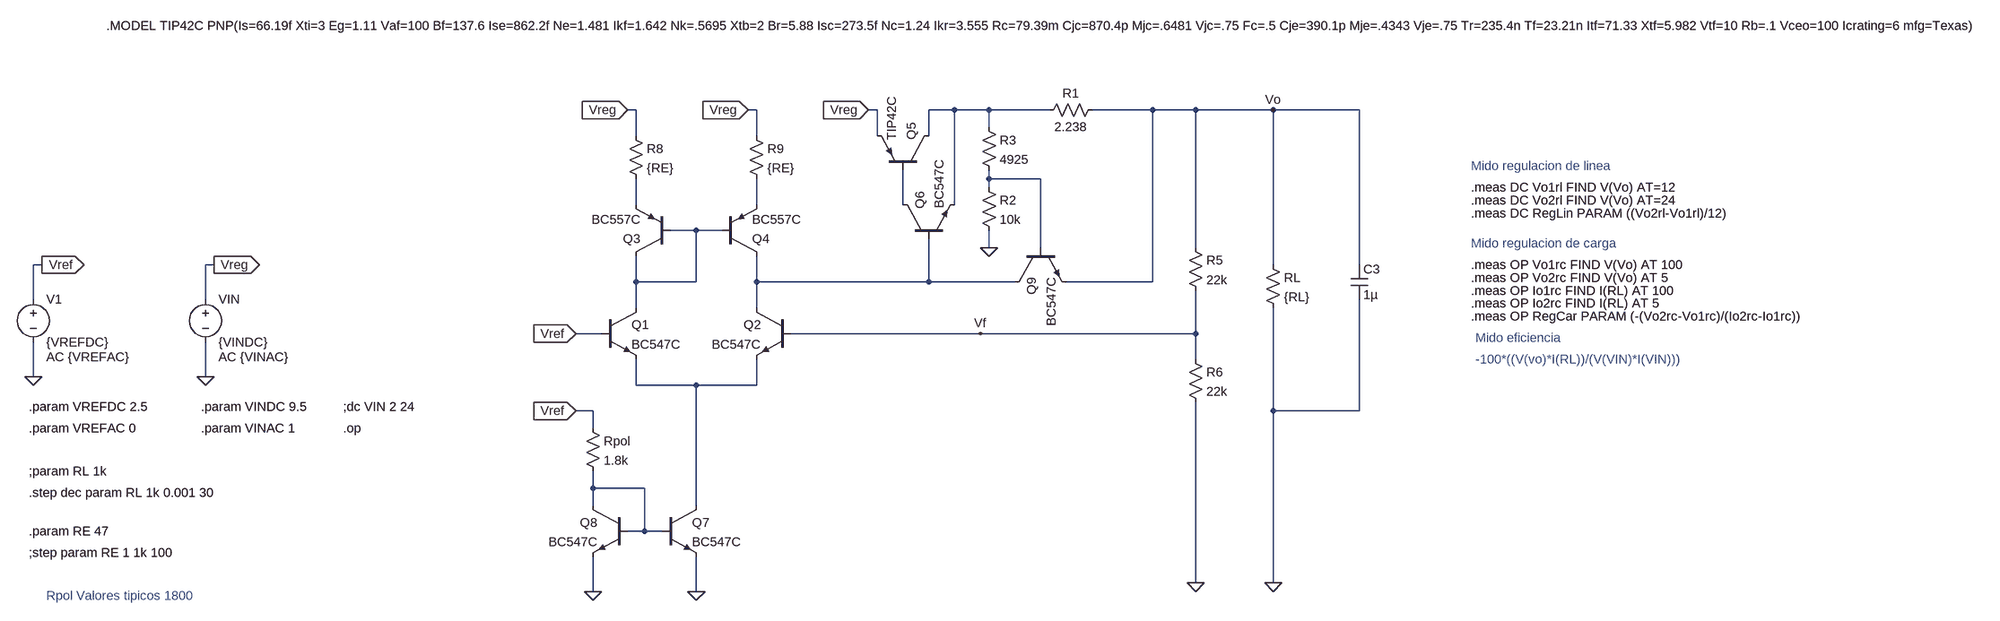
[diagram p0: schematic Version 2.asc]
Version 2.asc, the LTspice schematic file:
Version 4.1
SHEET 1 3148 1188
WIRE 96 -128 80 -128
WIRE 320 -128 304 -128
WIRE 544 -128 528 -128
WIRE 688 -128 640 -128
WIRE 752 -128 688 -128
WIRE 864 -128 752 -128
WIRE 1056 -128 944 -128
WIRE 1136 -128 1056 -128
WIRE 1280 -128 1136 -128
WIRE 1440 -128 1280 -128
WIRE 752 -96 752 -128
WIRE 96 -80 96 -128
WIRE 320 -80 320 -128
WIRE 544 -80 544 -128
WIRE 640 -80 640 -128
WIRE 752 0 752 -16
WIRE 848 0 752 0
WIRE 752 16 752 0
WIRE 96 48 96 0
WIRE 320 48 320 0
WIRE 592 48 592 -16
WIRE 688 48 688 -128
WIRE 208 96 160 96
WIRE 256 96 208 96
WIRE 752 128 752 96
WIRE 848 128 848 0
WIRE 1136 128 1136 -128
WIRE -1008 160 -1024 160
WIRE -688 160 -704 160
WIRE 1280 160 1280 -128
WIRE 1440 160 1440 -128
WIRE 96 192 96 144
WIRE 208 192 208 96
WIRE 208 192 96 192
WIRE 320 192 320 144
WIRE 640 192 640 112
WIRE 640 192 320 192
WIRE 800 192 640 192
WIRE 1056 192 1056 -128
WIRE 1056 192 896 192
WIRE -1024 224 -1024 160
WIRE -704 224 -704 160
WIRE 96 240 96 192
WIRE 320 240 320 192
WIRE 32 288 -16 288
WIRE 736 288 384 288
WIRE 1136 288 1136 208
WIRE 1136 288 736 288
WIRE 1136 336 1136 288
WIRE -1024 368 -1024 304
WIRE -704 368 -704 304
WIRE 96 384 96 336
WIRE 208 384 96 384
WIRE 320 384 320 336
WIRE 320 384 208 384
WIRE 16 432 -16 432
WIRE 1280 432 1280 240
WIRE 1440 432 1440 224
WIRE 1440 432 1280 432
WIRE 16 464 16 432
WIRE 16 576 16 544
WIRE 112 576 16 576
WIRE 16 608 16 576
WIRE 208 608 208 384
WIRE 112 656 112 576
WIRE 112 656 80 656
WIRE 144 656 112 656
WIRE 1136 752 1136 416
WIRE 1280 752 1280 432
WIRE 16 768 16 704
WIRE 208 768 208 704
FLAG 1280 -128 Vo
FLAG -1008 160 Vref
IOPIN -1008 160 Out
FLAG 736 288 Vf
FLAG -1024 368 0
FLAG -688 160 Vreg
IOPIN -688 160 Out
FLAG 1280 752 0
FLAG 1136 752 0
FLAG -16 288 Vref
IOPIN -16 288 In
FLAG -16 432 Vref
IOPIN -16 432 In
FLAG -704 368 0
FLAG 16 768 0
FLAG 208 768 0
FLAG 80 -128 Vreg
IOPIN 80 -128 In
FLAG 304 -128 Vreg
IOPIN 304 -128 In
FLAG 528 -128 Vreg
IOPIN 528 -128 In
FLAG 752 128 0
DATAFLAG 1440 -112 ""
DATAFLAG 512 288 ""
DATAFLAG 16 288 ""
DATAFLAG 368 192 ""
DATAFLAG 112 192 ""
DATAFLAG 224 96 ""
DATAFLAG 320 32 ""
SYMBOL pnp 160 144 R180
SYMATTR InstName Q3
SYMATTR Value BC557C
SYMBOL pnp 256 144 M180
SYMATTR InstName Q4
SYMATTR Value BC557C
SYMBOL npn 32 240 R0
SYMATTR InstName Q1
SYMATTR Value BC547C
SYMBOL npn 384 240 M0
SYMATTR InstName Q2
SYMATTR Value BC547C
SYMBOL pnp 640 -16 M270
SYMATTR InstName Q5
SYMATTR Value TIP42C
SYMBOL npn 592 112 R270
SYMATTR InstName Q6
SYMATTR Value BC547C
SYMBOL res 1120 112 R0
SYMATTR InstName R5
SYMATTR Value 22k
SYMBOL res 1120 320 R0
SYMATTR InstName R6
SYMATTR Value 22k
SYMBOL res 1264 144 R0
SYMATTR InstName RL
SYMATTR Value {RL}
SYMBOL voltage -1024 208 R0
WINDOW 123 24 124 Left 2
WINDOW 39 0 0 Left 0
SYMATTR Value2 AC {VREFAC}
SYMATTR InstName V1
SYMATTR Value {VREFDC}
SYMBOL res 80 -96 R0
SYMATTR InstName R8
SYMATTR Value {RE}
SYMBOL res 304 -96 R0
SYMATTR InstName R9
SYMATTR Value {RE}
SYMBOL cap 1424 160 R0
SYMATTR InstName C3
SYMATTR Value 1µ
SYMBOL voltage -704 208 R0
WINDOW 123 24 124 Left 2
WINDOW 39 0 0 Left 0
SYMATTR Value2 AC {VINAC}
SYMATTR InstName VIN
SYMATTR Value {VINDC}
SYMBOL npn 144 608 R0
SYMATTR InstName Q7
SYMATTR Value BC547C
SYMBOL npn 80 608 M0
SYMATTR InstName Q8
SYMATTR Value BC547C
SYMBOL res 0 448 R0
SYMATTR InstName Rpol
SYMATTR Value 1.8k
SYMBOL npn 800 128 M90
SYMATTR InstName Q9
SYMATTR Value BC547C
SYMBOL res 960 -144 R90
WINDOW 0 0 56 VBottom 2
WINDOW 3 32 56 VTop 2
SYMATTR InstName R1
SYMATTR Value 2.238
SYMBOL res 736 0 R0
SYMATTR InstName R2
SYMATTR Value 10k
SYMBOL res 736 -112 R0
SYMATTR InstName R3
SYMATTR Value 4925
TEXT -448 464 Left 2 !.op
TEXT -712 424 Left 2 !.param VINDC 9.5
TEXT -712 464 Left 2 !.param VINAC 1
TEXT -1032 424 Left 2 !.param VREFDC 2.5
TEXT -1032 464 Left 2 !.param VREFAC 0
TEXT -1032 544 Left 2 !;param RL 1k
TEXT -448 424 Left 2 !;dc VIN 2 24
TEXT -1032 696 Left 2 !;step param RE 1 1k 100
TEXT -1032 656 Left 2 !.param RE 47
TEXT -1032 584 Left 2 !.step dec param RL 1k 0.001 30
TEXT 1648 -24 Left 2 ;Mido regulacion de linea
TEXT 1648 16 Left 2 !.meas DC Vo1rl FIND V(Vo) AT=12
TEXT 1648 40 Left 2 !.meas DC Vo2rl FIND V(Vo) AT=24
TEXT 1648 64 Left 2 !.meas DC RegLin PARAM ((Vo2rl-Vo1rl)/12)
TEXT 1648 120 Left 2 ;Mido regulacion de carga
TEXT 1648 160 Left 2 !.meas OP Vo1rc FIND V(Vo) AT 100
TEXT 1648 184 Left 2 !.meas OP Vo2rc FIND V(Vo) AT 5
TEXT 1648 208 Left 2 !.meas OP Io1rc FIND I(RL) AT 100
TEXT 1648 232 Left 2 !.meas OP Io2rc FIND I(RL) AT 5
TEXT 1656 296 Left 2 ;Mido eficiencia
TEXT 1656 336 Left 2 ;-100*((V(vo)*I(RL))/(V(VIN)*I(VIN)))
TEXT 1648 256 Left 2 !.meas OP RegCar PARAM (-(Vo2rc-Vo1rc)/(Io2rc-Io1rc))
TEXT -1000 776 Left 2 ;Rpol Valores tipicos 1800
TEXT -888 -312 Left 2 !.MODEL TIP42C PNP(Is=66.19f Xti=3 Eg=1.11 Vaf=100 Bf=137.6 Ise=862.2f Ne=1.481 Ikf=1.642 Nk=.5695 Xtb=2 Br=5.88 Isc=273.5f Nc=1.24 Ikr=3.555 Rc=79.39m Cjc=870.4p Mjc=.6481 Vjc=.75 Fc=.5 Cje=390.1p Mje=.4343 Vje=.75 Tr=235.4n Tf=23.21n Itf=71.33 Xtf=5.982 Vtf=10 Rb=.1 Vceo=100 Icrating=6 mfg=Texas)

The netlist it stands for:
* Version 2.asc
Q3 N006 N006 N003 0 BC557C
Q4 N007 N006 N004 0 BC557C
Q1 N006 Vref N008 0 BC547C
Q2 N007 Vf N008 0 BC547C
Q5 N001 N005 Vreg 0 TIP42C
Q6 N005 N007 N001 0 BC547C
R5 Vo Vf 22k
R6 Vf 0 22k
RL Vo 0 {RL}
V1 Vref 0 {VREFDC} AC {VREFAC}
R8 Vreg N003 {RE}
R9 Vreg N004 {RE}
C3 Vo 0 1µ
VIN Vreg 0 {VINDC} AC {VINAC}
Q7 N008 N009 0 0 BC547C
Q8 N009 N009 0 0 BC547C
Rpol Vref N009 1.8k
Q9 N007 N002 Vo 0 BC547C
R1 Vo N001 2.238
R2 N002 0 10k
R3 N001 N002 4925
.model NPN NPN
.model PNP PNP
.lib standard.bjt
.op
.param VINDC 9.5
.param VINAC 1
.param VREFDC 2.5
.param VREFAC 0
;param RL 1k
;dc VIN 2 24
;step param RE 1 1k 100
.param RE 47
.step dec param RL 1k 0.001 30
* Mido regulacion de linea
.meas DC Vo1rl FIND V(Vo) AT=12
.meas DC Vo2rl FIND V(Vo) AT=24
.meas DC RegLin PARAM ((Vo2rl-Vo1rl)/12)
* Mido regulacion de carga
.meas OP Vo1rc FIND V(Vo) AT 100
.meas OP Vo2rc FIND V(Vo) AT 5
.meas OP Io1rc FIND I(RL) AT 100
.meas OP Io2rc FIND I(RL) AT 5
* Mido eficiencia
* -100*((V(vo)*I(RL))/(V(VIN)*I(VIN)))
.meas OP RegCar PARAM (-(Vo2rc-Vo1rc)/(Io2rc-Io1rc))
* Rpol Valores tipicos 1800
.MODEL TIP42C PNP(Is=66.19f Xti=3 Eg=1.11 Vaf=100 Bf=137.6 Ise=862.2f Ne=1.481 Ikf=1.642 Nk=.5695 Xtb=2 Br=5.88 Isc=273.5f Nc=1.24 Ikr=3.555 Rc=79.39m Cjc=870.4p Mjc=.6481 Vjc=.75 Fc=.5 Cje=390.1p Mje=.4343 Vje=.75 Tr=235.4n Tf=23.21n Itf=71.33 Xtf=5.982 Vtf=10 Rb=.1 Vceo=100 Icrating=6 mfg=Texas)
.backanno
.end

* Results of the author's LTspice run, read from the files saved beside the schematic
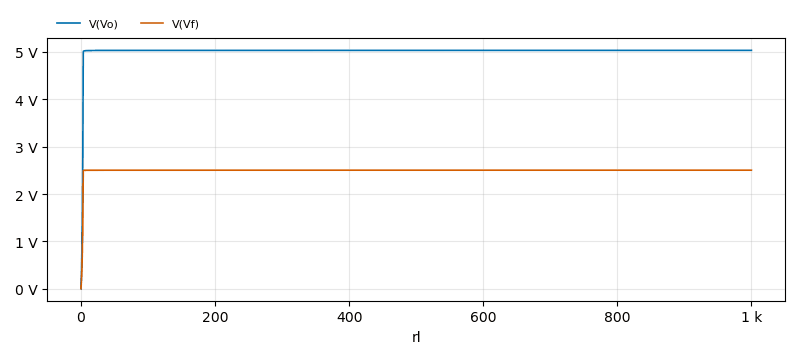
[diagram p1: Operating Point of Version 2.asc, plotted from the saved traces]
* Operating Point, 1 run:
*   V(Vo): 423.6 µV at rl=1 m, 5.031 V at rl=1 k, min 423.6 µV, max 5.031 V
*   V(Vf): 211.8 µV at rl=1 m, 2.503 V at rl=1 k, min 211.8 µV, max 2.503 V
* From the log:
*   vo1rc: V(Vo)=5.03083562851 at 100
*   vo2rc: V(Vo)=5.02114825105 at 5
*   io1rc: I(RL)=0.0503083541989 at 100
*   io2rc: I(RL)=1.00441288738 at 5
*   regcar: (-(Vo2rc-Vo1rc)/(Io2rc-Io1rc))=0.0101533711708